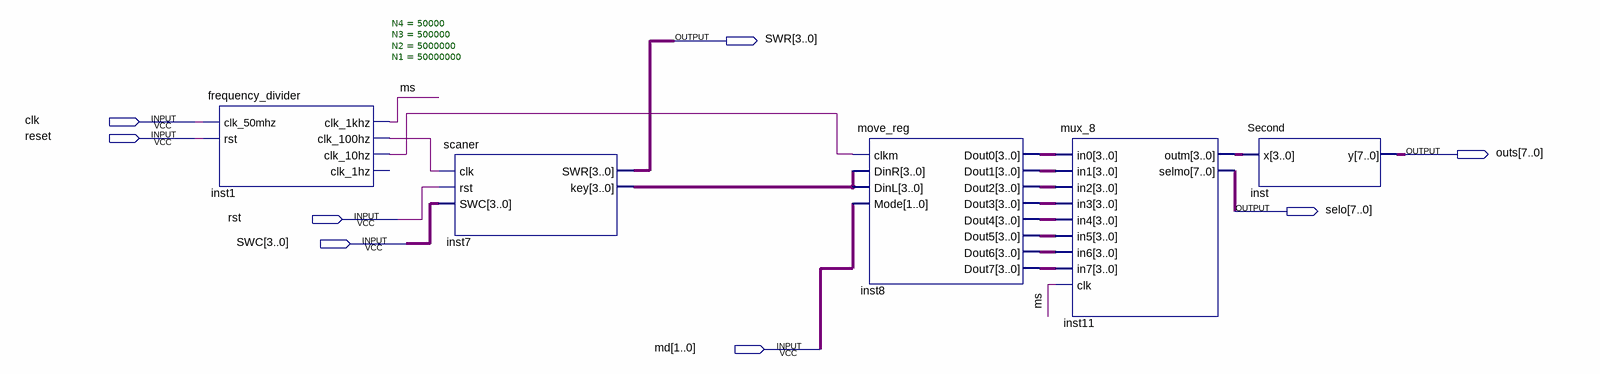
[diagram p0: schematic sheet]
// Quartus schematic Eleventhproject.bdf as structural Verilog: 5 symbols, 8 pins
module Eleventhproject (
  input  clk,
  input  reset,
  input  rst,
  input  [3:0] SWC,
  input  [1:0] md,
  output [3:0] SWR,
  output [7:0] outs,
  output [7:0] selo
);

  wire inst1_clk_10hz, inst1_clk_100hz, ms;
  wire [3:0] inst7_key, inst8_dout0, inst8_dout1, inst8_dout2, inst8_dout3, inst8_dout4, inst8_dout5,
       inst8_dout6, inst8_dout7, inst11_outm;

  frequency_divider #(.N4(50000), .N3(500000), .N2(5000000), .N1(50000000)) inst1 (
    .clk_50mhz(clk), .rst(reset), .clk_1khz(ms), .clk_100hz(inst1_clk_100hz), .clk_10hz(inst1_clk_10hz));  // open: clk_1hz
  scaner inst7 (.clk(inst1_clk_100hz), .rst(rst), .SWC(SWC), .SWR(SWR), .key(inst7_key));
  move_reg inst8 (
    .clkm(inst1_clk_10hz), .DinR(inst7_key), .DinL(inst7_key), .Mode(md), .Dout0(inst8_dout0),
    .Dout1(inst8_dout1), .Dout2(inst8_dout2), .Dout3(inst8_dout3), .Dout4(inst8_dout4), .Dout5(inst8_dout5),
    .Dout6(inst8_dout6), .Dout7(inst8_dout7));
  mux_8 inst11 (
    .in0(inst8_dout0), .in1(inst8_dout1), .in2(inst8_dout2), .in3(inst8_dout3), .in4(inst8_dout4),
    .in5(inst8_dout5), .in6(inst8_dout6), .in7(inst8_dout7), .clk(ms), .outm(inst11_outm), .selmo(selo));
  Second inst (.x(inst11_outm), .y(outs));
endmodule
